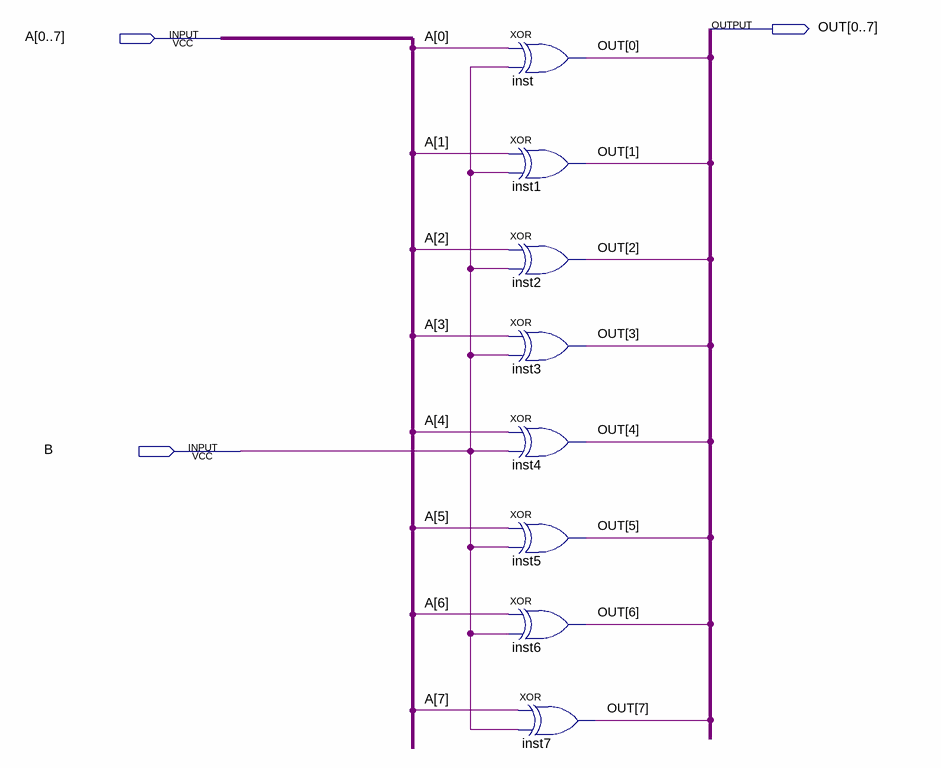
[diagram p0: schematic sheet]
// Quartus schematic EightBitXOR.bdf as structural Verilog: 8 symbols, 3 pins
module EightBitXOR (
  input  [0:7] A,
  input  B,
  output [0:7] OUT
);

  xor inst (OUT[0], A[0], B);
  xor inst1 (OUT[1], A[1], B);
  xor inst2 (OUT[2], A[2], B);
  xor inst3 (OUT[3], A[3], B);
  xor inst4 (OUT[4], A[4], B);
  xor inst5 (OUT[5], A[5], B);
  xor inst6 (OUT[6], A[6], B);
  xor inst7 (OUT[7], A[7], B);
endmodule
